# Altium schematic sheet St3025_Servo_Schematic.SchDoc
size A4; DocumentNumber: 4; SheetNumber: 4; SheetTotal: 5
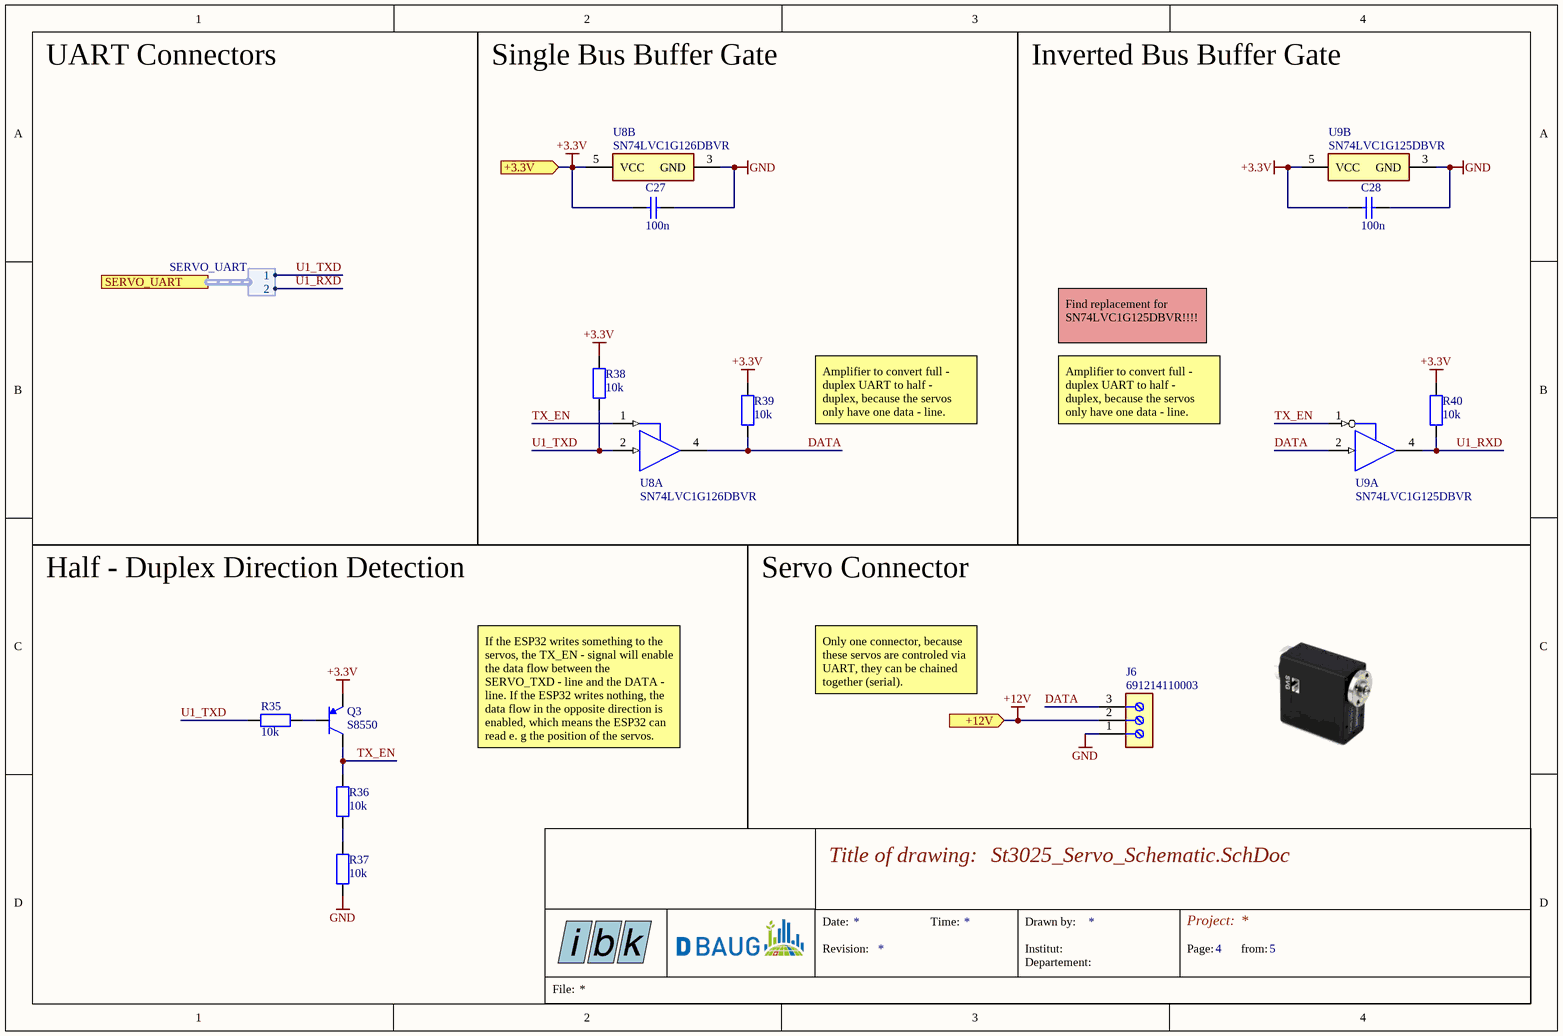
[diagram p0: St3025_Servo_Schematic.SchDoc]

## Parts
C27  100n  [0603_CAPACITOR]
C28  100n  [0603_CAPACITOR]
J6  691214110003  [Screw_Connector]
Q3  S8550  [PNP_Bipolar_Transistor]
R35  10k  [Resistor_0603]
R36  10k  [Resistor_0603]
R37  10k  [Resistor_0603]
R38  10k  [Resistor_0603]
R39  10k  [Resistor_0603]
R40  10k  [Resistor_0603]
U8  SN74LVC1G126DBVR  [DBV0005A_L_Single_Bus_Buffer_Gate]  (parts A,B of 2)
U9  SN74LVC1G125DBVR  [DBV0005A_L_Single_Bus_Buffer_Gate]  (parts A,B of 2)

## Ports
+3.3V (in), +12V (in), SERVO_UART (harness SERVO_UART)

## Harnesses
SERVO_UART: 1, 2

## Nets
+3.3V: C27.2 C28.2 Q3.2(E) R38.2 R39.2 R40.2 U8.5(VCC) U9.5(VCC) ; port +3.3V
+12V: J6.2 ; port +12V
GND: C27.1 C28.1 J6.1 R37.1 U8.3(GND) U9.3(GND)
DATA: J6.3 R39.1 U8.4(Y) U9.2(A)
TX_EN: Q3.3(C) R36.2 U8.1(OE) U9.1(OE)
U1_RXD: R40.1 U9.4(Y) ; port SERVO_UART.2
U1_TXD: R35.2 R38.1 U8.2(A) ; port SERVO_UART.1
NetQ3_1: Q3.1(B) R35.1
NetR36_1: R36.1 R37.2

## Notes on the sheet
- UART Connectors
- Single Bus Buffer Gate
- Inverted Bus Buffer Gate
- Find replacement for SN74LVC1G125DBVR!!!!
- Amplifier to convert full - duplex UART to half - duplex, because the servos only have one data - line.
- Half - Duplex Direction Detection
- Servo Connector
- Only one connector, because these servos are controled via UART, they can be chained together (serial).
- If the ESP32 writes something to the servos, the TX_EN - signal will enable the data flow between the SERVO_TXD - line and the DATA - line. If the ESP32 writes nothing, the data flow in the opposite direction is enabled, which means the ESP32 can read e. g the position of the servos.
- Date:
- Title of drawing:
- Time:
- Drawn by:
- Project:
- Revision:
- Institut:
- Departement:
- Page:
- from:
- File:

## Library data of the parts
C27 C28 = Capacitor_0603: 0603
J6 = Screw_Connector: 691214110003 Wurth Elektronik
Q3 = PNP_Bipolar_Transistor: Bipolar (BJT) Transistor PNP 25 V 500 mA 150MHz 300 mW Surface Mount SOT-23.
R35-R40 = Resistor_0603: 0603
U8 = Single_Bus_Buffer_Gate: Single Bus Buffer Gate With 3-State Outputs, DBV0005A, LARGE T&R.; ComponentLink1Description: Supplier; ComponentLink1URL: https://www.digikey.com/en/products/detail/texas-instruments/SN74LVC1G126DBVR/385722
U9 = Single_Bus_Buffer_Gate_Inverted: Single Bus Buffer Gate With 3-State Outputs, DBV0005A, LARGE T&R.; ComponentLink1Description: Supplier; ComponentLink1URL: *